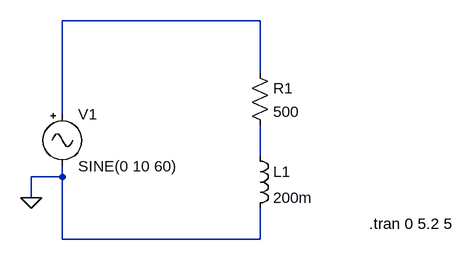
[diagram p0: schematic Different_loads_test.asc]
Different_loads_test.asc, the LTspice schematic file:
Version 4.1
SHEET 1 880 680
WIRE 416 -16 112 -16
WIRE 416 64 416 -16
WIRE 112 128 112 -16
WIRE 416 192 416 144
WIRE 112 224 112 208
WIRE 112 224 64 224
WIRE 64 256 64 224
WIRE 112 320 112 224
WIRE 416 320 416 272
WIRE 416 320 112 320
FLAG 64 256 0
SYMBOL Misc\\signal 112 112 R0
WINDOW 123 0 0 Left 0
WINDOW 39 0 0 Left 0
SYMATTR InstName V1
SYMATTR Value SINE(0 10 60)
SYMBOL res 400 48 R0
SYMATTR InstName R1
SYMATTR Value 500
SYMBOL ind 400 176 R0
SYMATTR InstName L1
SYMATTR Value 200m
SYMATTR SpiceLine Rser=0
TEXT 584 296 Left 2 !.tran 0 5.2 5

The netlist it stands for:
* Different_loads_test.asc
V1 N001 0 SINE(0 10 60)
R1 N001 N002 500
L1 N002 0 200m Rser=0
.tran 0 5.2 5
.backanno
.end